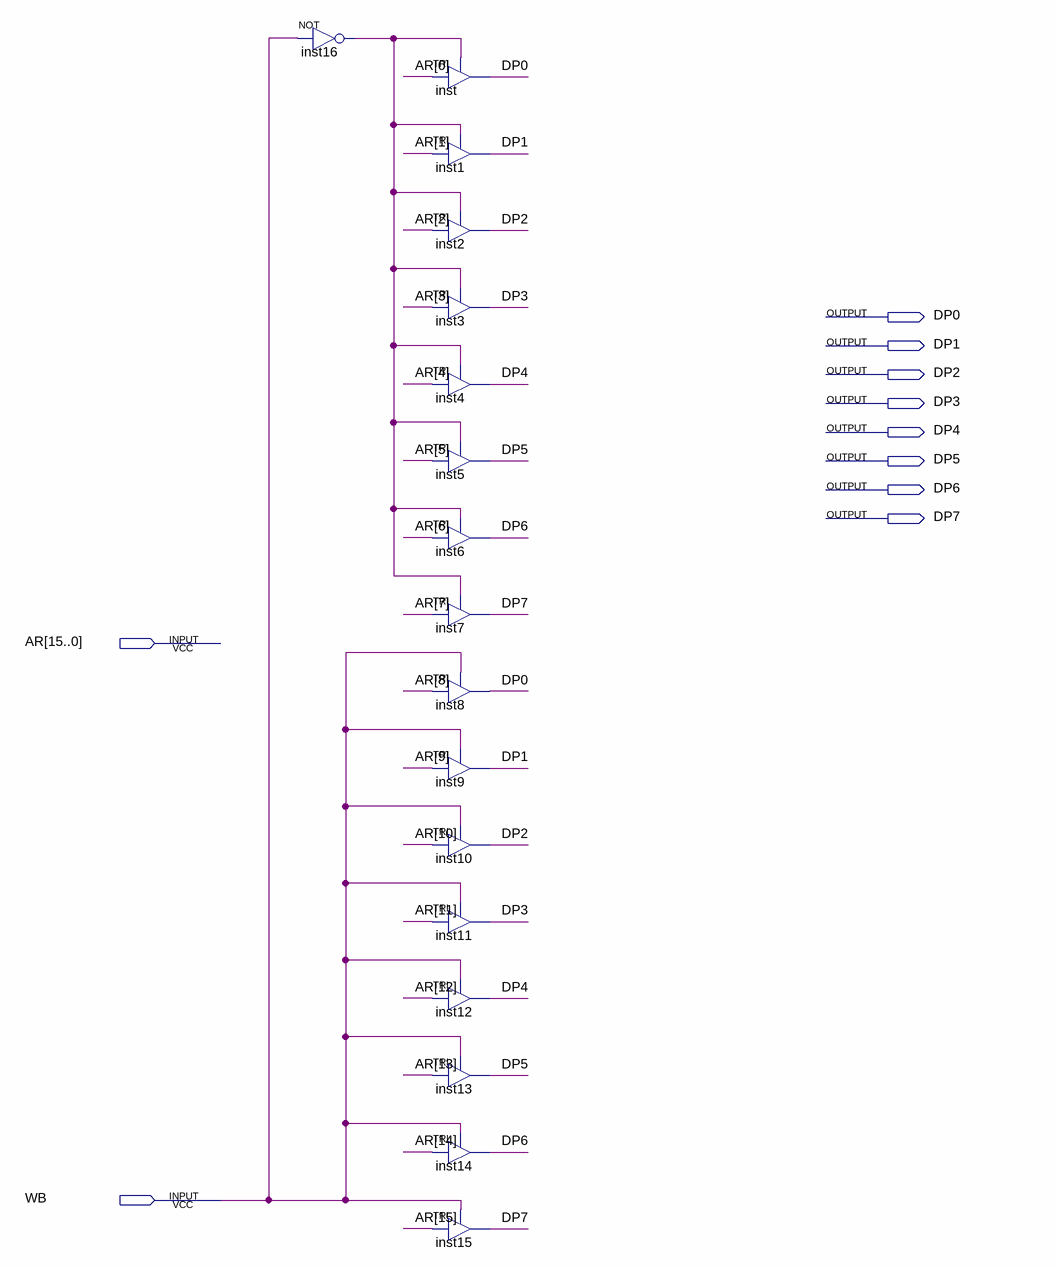
[diagram p0: schematic sheet]
// Quartus schematic Multiplexer_H2L.bdf as structural Verilog: 17 symbols, 10 pins
module Multiplexer_H2L (
  input  [15:0] AR,
  input  WB,
  output DP0,
  output DP1,
  output DP2,
  output DP3,
  output DP4,
  output DP5,
  output DP6,
  output DP7
);

  wire inst16_out;

  not inst16 (inst16_out, WB);
  TRI inst (.IN(AR[0]), .OE(inst16_out), .OUT(DP0));
  TRI inst1 (.IN(AR[1]), .OE(inst16_out), .OUT(DP1));
  TRI inst2 (.IN(AR[2]), .OE(inst16_out), .OUT(DP2));
  TRI inst3 (.IN(AR[3]), .OE(inst16_out), .OUT(DP3));
  TRI inst4 (.IN(AR[4]), .OE(inst16_out), .OUT(DP4));
  TRI inst5 (.IN(AR[5]), .OE(inst16_out), .OUT(DP5));
  TRI inst6 (.IN(AR[6]), .OE(inst16_out), .OUT(DP6));
  TRI inst7 (.IN(AR[7]), .OE(inst16_out), .OUT(DP7));
  TRI inst8 (.IN(AR[8]), .OE(WB), .OUT(DP0));
  TRI inst9 (.IN(AR[9]), .OE(WB), .OUT(DP1));
  TRI inst10 (.IN(AR[10]), .OE(WB), .OUT(DP2));
  TRI inst11 (.IN(AR[11]), .OE(WB), .OUT(DP3));
  TRI inst12 (.IN(AR[12]), .OE(WB), .OUT(DP4));
  TRI inst13 (.IN(AR[13]), .OE(WB), .OUT(DP5));
  TRI inst14 (.IN(AR[14]), .OE(WB), .OUT(DP6));
  TRI inst15 (.IN(AR[15]), .OE(WB), .OUT(DP7));
endmodule
